# EAGLE design TOP_BEE_DEMO (EAGLE 6.5.0)
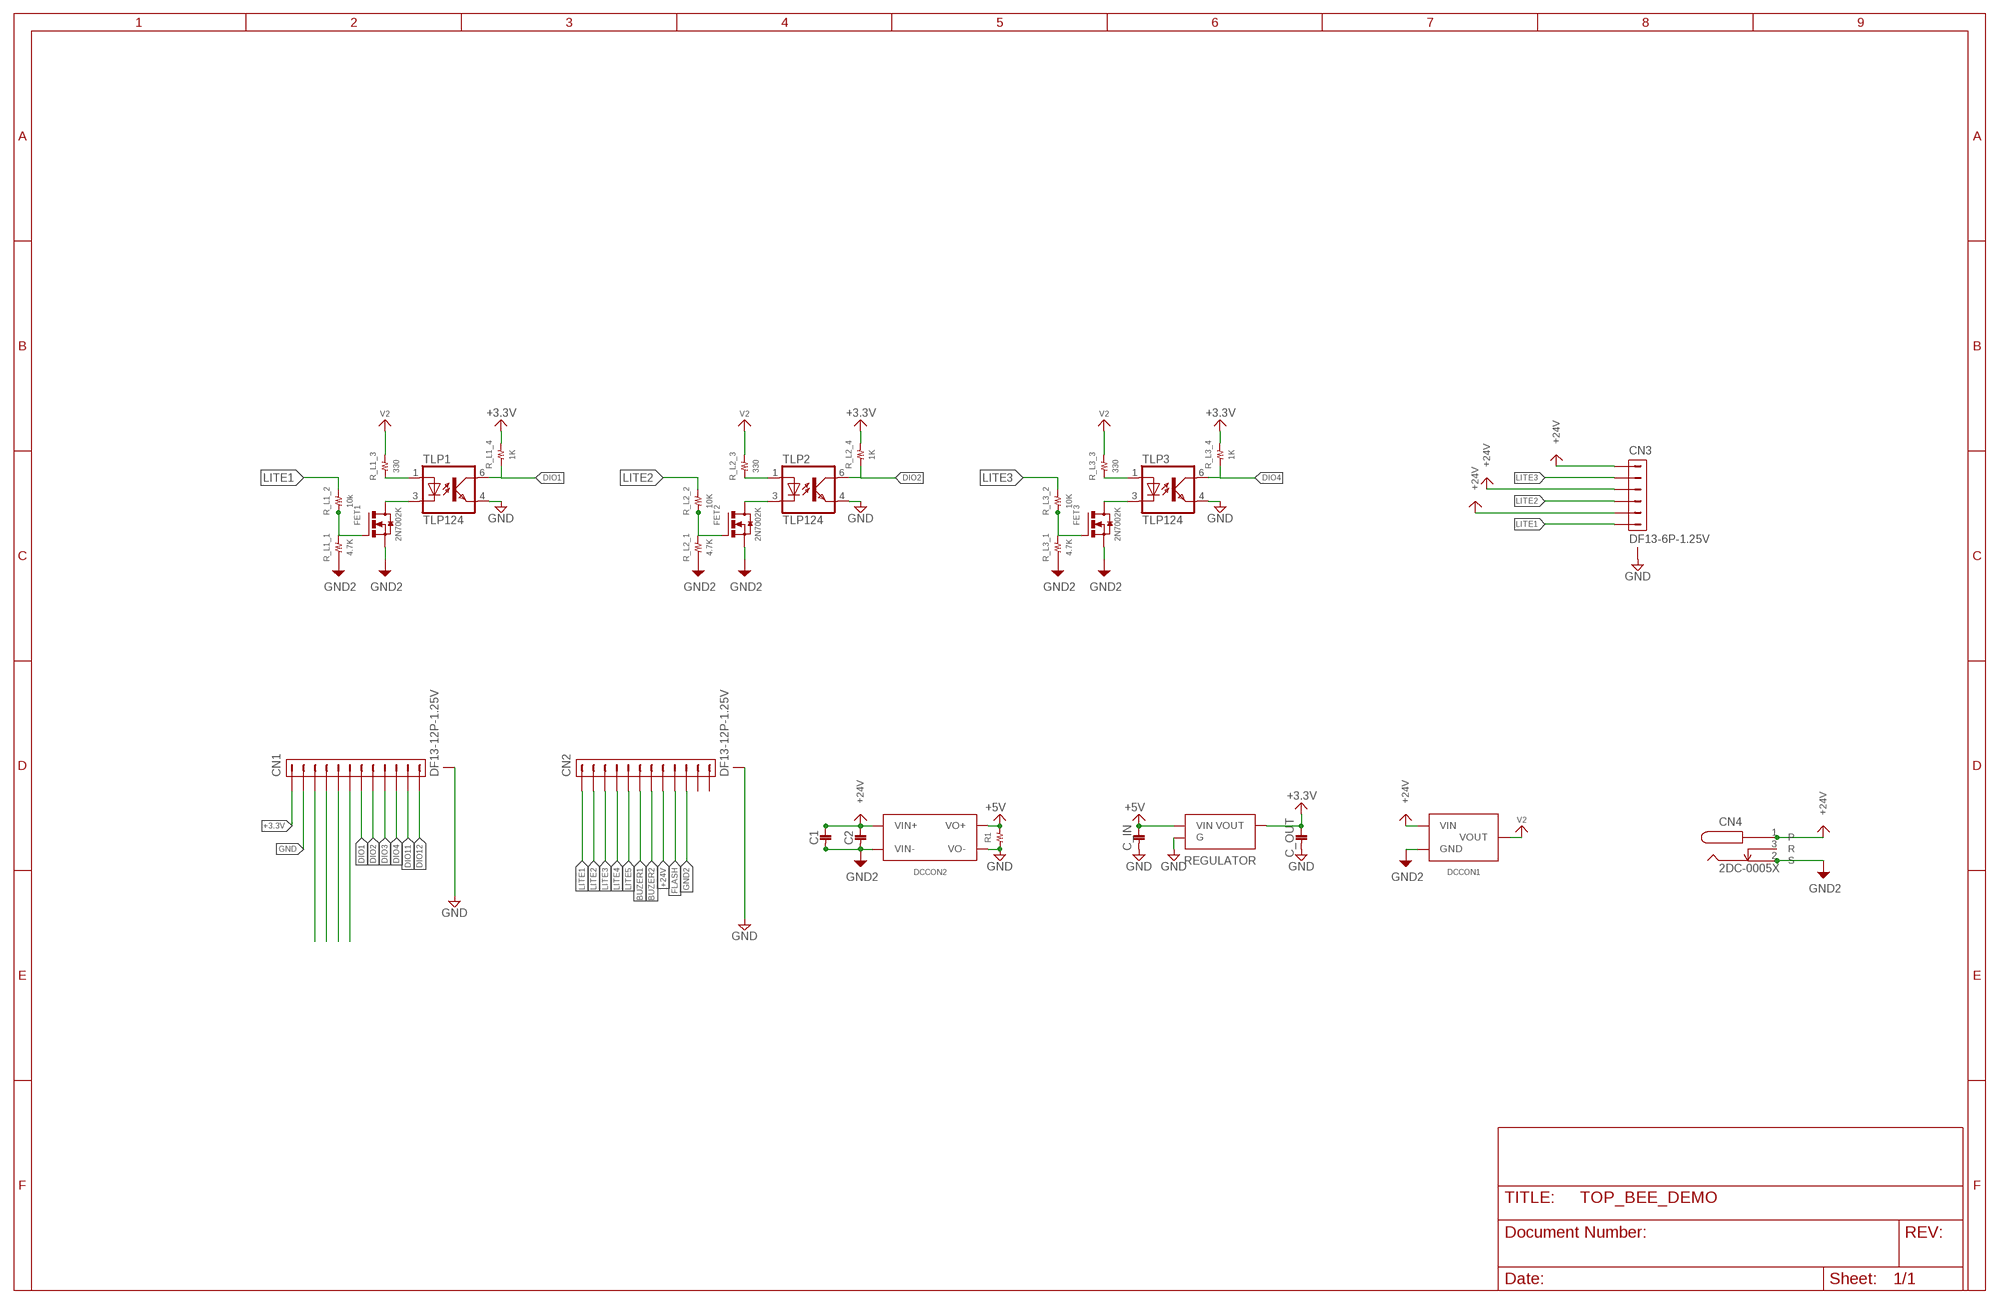
[diagram p0: schematic, sheet 1]

## Parts
C1  3225  [3225]
C2  1608  [1608]
C_IN  1608  [1608]
C_OUT  1608  [1608]
CN1  DF13-12P-1.25V  [DF13C-12P-1.25V]
CN2  DF13-12P-1.25V  [DF13C-12P-1.25V]
CN3  DF13-6P-1.25V  [DF13C-6P-1.25V]
CN4  2DC-0005X  [2DC-0005D]
DCCON1  Ｒ－７８Ｅ５．０  [Ｒ－７８Ｅ５．０]
DCCON2  MAU100  [MAU]
FET1  2N7002K  CHIP_FET  [SOT23]
FET2  2N7002K  CHIP_FET  [SOT23]
FET3  2N7002K  CHIP_FET  [SOT23]
R1  RESISTOR__SMD  [1608]
R_L1_1  4.7K  RESISTOR__SMD  [1608]
R_L1_2  10k  RESISTOR__SMD  [1608]
R_L1_3  330  RESISTOR__SMD  [1608]
R_L1_4  1K  RESISTOR__SMD  [1608]
R_L2_1  4.7K  RESISTOR__SMD  [1608]
R_L2_2  10K  RESISTOR__SMD  [1608]
R_L2_3  330  RESISTOR__SMD  [1608]
R_L2_4  1K  RESISTOR__SMD  [1608]
R_L3_1  4.7K  RESISTOR__SMD  [1608]
R_L3_2  10K  RESISTOR__SMD  [1608]
R_L3_3  330  RESISTOR__SMD  [1608]
R_L3_4  1K  RESISTOR__SMD  [1608]
REGULATOR  NJM2845  [TO252]
TLP1  TLP124  [11−4C1]
TLP2  TLP124  [11−4C1]
TLP3  TLP124  [11−4C1]

## Nets
2N7002K: FET1.1(G) R_L1_1.2 R_L1_2.1
+3.3V: C_OUT.P$1 CN1.P$1 R_L1_4.2 R_L2_4.2 R_L3_4.2 REGULATOR.3(VOUT)
+5V: C_IN.P$1 DCCON2.P$5(VO+) R1.2 REGULATOR.1(VIN)
+24V [24v]: C1.P$1 C2.P$1 CN2.P$8 CN3.P$1 CN3.P$3 CN3.P$5 CN4.1(P) DCCON1.1(VIN) DCCON2.P$1(VIN+)
BUZER1: CN2.P$6
BUZER2: CN2.P$7
DIO1: CN1.P$7 R_L1_4.1 TLP1.6(COL)
DIO2: CN1.P$8 R_L2_4.1 TLP2.6(COL)
DIO3: CN1.P$9
DIO4: CN1.P$10 R_L3_4.1 TLP3.6(COL)
DIO11: CN1.P$11
DIO12: CN1.P$12
FLASH: CN2.P$9
GND: C_IN.P$2 C_OUT.P$2 CN1.G1(G) CN1.G2(G) CN1.M$0(G) CN1.M$1(G) CN1.P$2 CN2.G1(G) CN2.G2(G) CN2.M$0(G) CN2.M$1(G) CN3.G1(G) CN3.G2(G) CN3.M$0(G) CN3.M$1(G) DCCON2.P$3(VO-) R1.1 REGULATOR.2(G) TLP1.4(EMIT) TLP2.4(EMIT) TLP3.4(EMIT)
GND2 [24v]: C1.P$2 C2.P$2 CN2.P$10 CN4.2(S) DCCON1.2(GND) DCCON2.P$2(VIN-) FET1.2(S) FET2.2(S) FET3.2(S) R_L1_1.1 R_L2_1.1 R_L3_1.1
LITE1 [24vSig]: CN2.P$1 CN3.P$6 R_L1_2.2
LITE2 [24vSig]: CN2.P$2 CN3.P$4 R_L2_2.2
LITE3 [24vSig]: CN2.P$3 CN3.P$2 R_L3_2.2
LITE4: CN2.P$4
LITE5: CN2.P$5
N$1: FET2.3(D) TLP2.3(C)
N$2: FET1.3(D) TLP1.3(C)
N$3: R_L1_3.1 TLP1.1(A)
N$4: CN1.P$3
N$5: R_L2_3.1 TLP2.1(A)
N$6: FET2.1(G) R_L2_1.2 R_L2_2.1
N$7: FET3.3(D) TLP3.3(C)
N$8: R_L3_3.1 TLP3.1(A)
N$9: FET3.1(G) R_L3_1.2 R_L3_2.1
N$10: CN1.P$4
N$13: CN1.P$5
N$14: CN1.P$6
V2: DCCON1.3(VOUT) R_L1_3.2 R_L2_3.2 R_L3_3.2
Unconnected: CN2.P$11 CN2.P$12 CN4.3(R)

## Library data of the parts
C1 = 02_C:3225
C2 C_IN C_OUT = 02_C:1608
CN1 CN2 = con-hirose-df13:DF13-12P-1.25: DF13-12P 1.25mm Pitch Miniature Crimping Connector.
CN3 = con-hirose-df13:DF13-6P-1.25: DF13-6P 1.25mm Pitch Miniature Crimping Connector.
CN4 = marushin:2DC-0005X
DCCON1 = 04_IC:Ｒ－７８Ｅ５．０
DCCON2 = 04_IC:MAU100
FET1-FET3 = 06_FET:CHIP_FET
R1 R_L1_1-R_L1_4 R_L2_1-R_L2_4 R_L3_1-R_L3_4 = 01_R:RESISTOR__SMD
REGULATOR = 04_IC:NJM2845
TLP1-TLP3 = 04_IC:TLP124

## Net classes
0 default: width 0.4 mm, clearance 0.3 mm
1 24v: width 0.4 mm, clearance 0.5 mm
2 10v: width 0.008 mm
3 24vSig: width 0.3 mm, clearance 0.5 mm

## Board
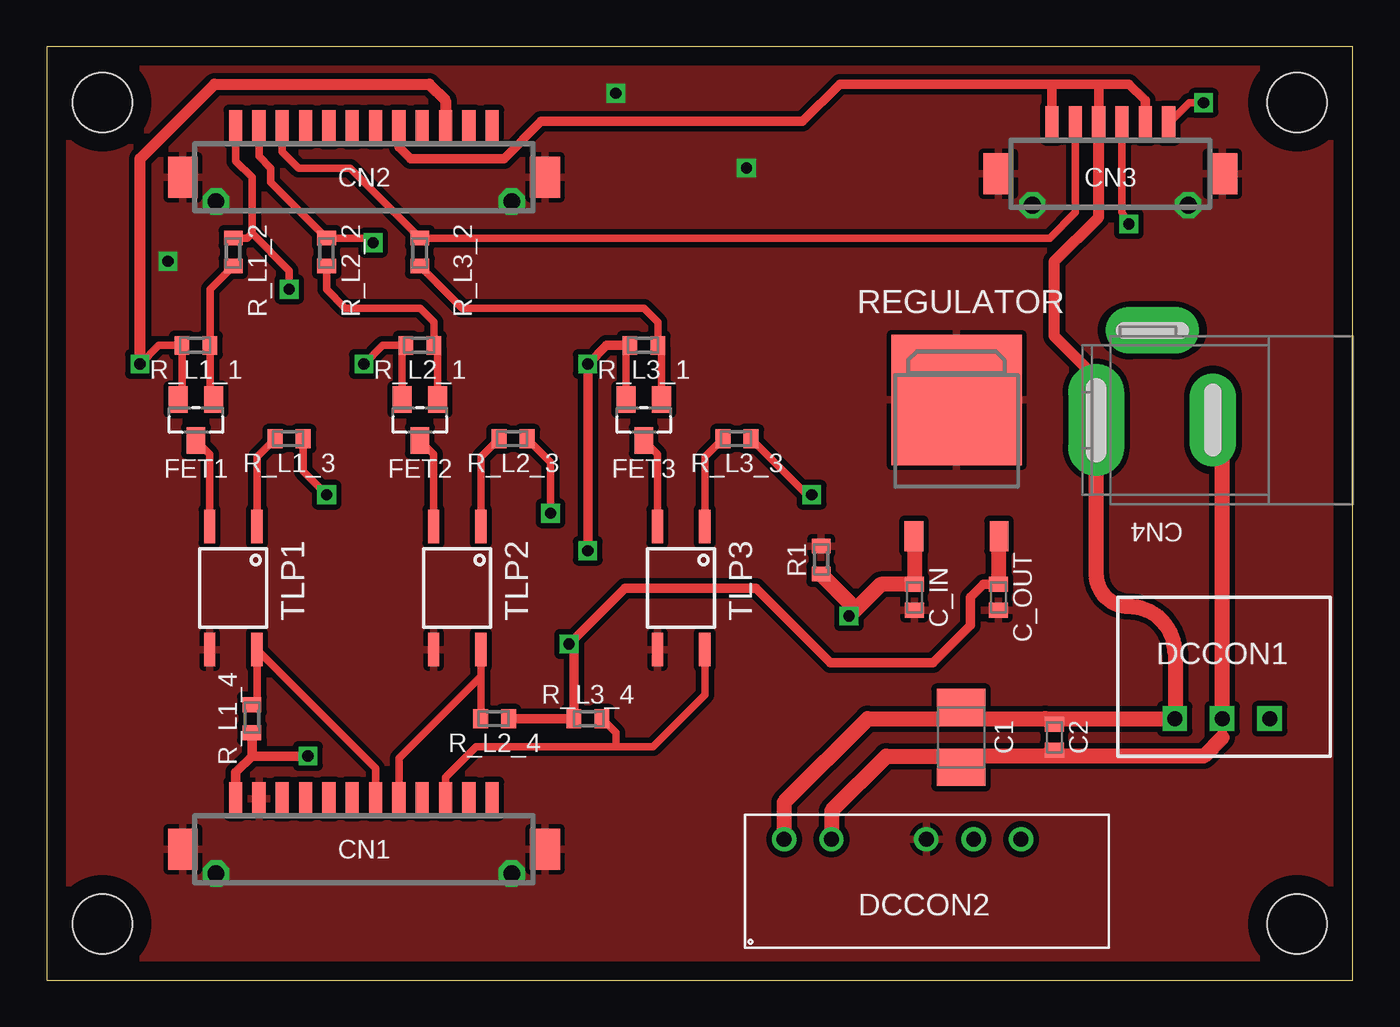
[diagram p1: board, top side]
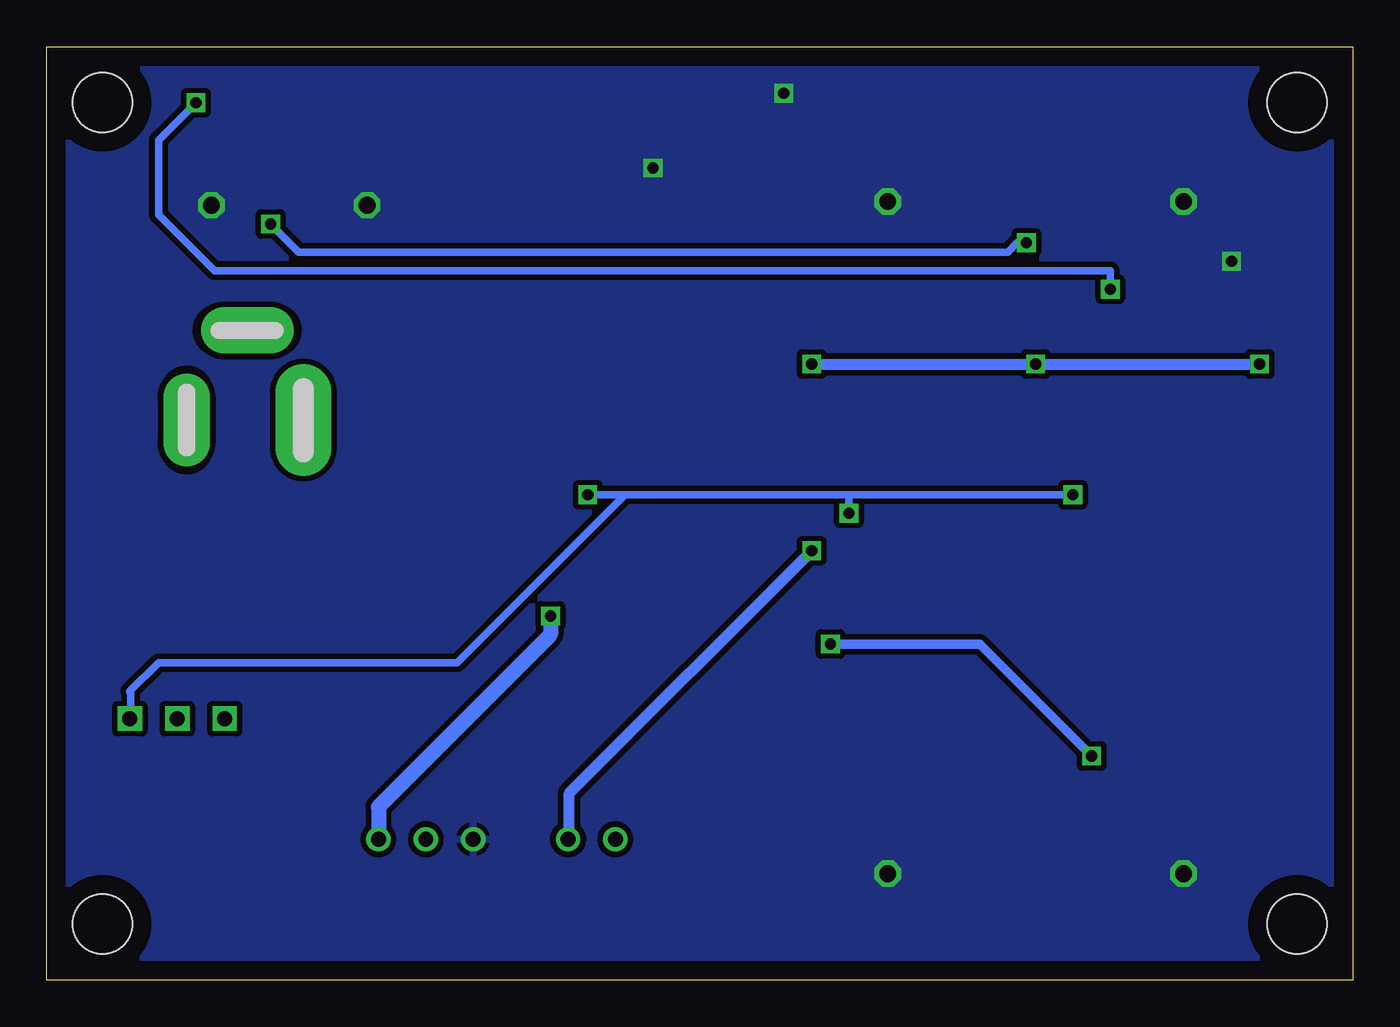
[diagram p2: board, bottom side, seen from below]

Size 70 x 50 mm. Coordinates in mm from the lower left corner, seen from the top.
Outline: 0,0 70,0 70,50 0,50 0,0
Copper layers (1*16): Top 0.035mm / dielectric 1.5mm / Bottom 0.035mm
Design rules "default *": minimum track width 10mil, minimum drill 0.5mil, track to track 8mil, track to pad 8mil, pad to pad 8mil, via to via 8mil, smd to smd 8mil, copper to edge 40mil, drill to drill 8mil, minimum pad ring 10mil, minimum via ring 8mil, stop-mask expansion 4mil, vias tented up to drill 0mil, thermal gap 10mil
Holes 3.2 mm at 3,47 67,47 67,3 3,3

### Footprints (pad centres in the part's own frame; a part is rotated, then mirrored left to right if it is on the bottom)
3225 = smd 2 x 2.6: P$1 -1.6,0; P$2 1.6,0
1608 = smd 0.8 x 1: P$1 -0.7,0; P$2 0.7,0
DF13C-12P-1.25V = drill 0.9 octagon: G1 -7.925,-1.3; G2 7.925,-1.3 | smd 1.6 x 2.2: M$0 9.7,0; M$1 -9.7,0 | smd 0.7 x 1.8: P$1 -6.875,2.7; P$2 -5.625,2.7; P$3 -4.375,2.7; P$4 -3.125,2.7; P$5 -1.875,2.7; P$6 -0.625,2.7; P$7 0.625,2.7; P$8 1.875,2.7; P$9 3.125,2.7; P$10 4.375,2.7; P$11 5.625,2.7; P$12 6.875,2.7
DF13C-6P-1.25V = drill 0.9 octagon: G1 -4.175,-3.5; G2 4.175,-3.5 | smd 1.6 x 2.2: M$0 6,-1.8; M$1 -6,-1.8 | smd 0.7 x 1.8: P$1 -3.125,0.9; P$2 -1.875,0.9; P$3 -0.625,0.9; P$4 0.625,0.9; P$5 1.875,0.9; P$6 3.125,0.9
2DC-0005D = drill 0.8 pad 3 long: 1 6.25,0 | drill 0.8 pad 2.5 long: 2 0,0; 3 3.25,-4.8 | hole 0.8: 0,0.1; 0,0.2; 0,0.3; 0,0.4; 0,0.5; 0,0.6; 0,0.7; 0,0.8; 0,0.9; 0,1; 0,1.1; 0,1.2; 0,1.3; 0,1.4; 0,1.5; 0,-0.1; 0,-0.2; 0,-0.3; 0,-0.4; 0,-0.5; 0,-0.6; 0,-0.7; 0,-0.8; 0,-0.9; 0,-1; 0,-1.1; 0,-1.2; 0,-1.3; 0,-1.4; 0,-1.5; 3.25,-4.8; 3.35,-4.8; 3.45,-4.8; 3.55,-4.8; 3.65,-4.8; 3.75,-4.8; 3.85,-4.8; 3.95,-4.8; 4.05,-4.8; 4.15,-4.8; 4.25,-4.8; 4.35,-4.8; 4.45,-4.8; 4.55,-4.8; 4.65,-4.8; 4.75,-4.8; 3.15,-4.8; 3.05,-4.8; 2.95,-4.8; 2.85,-4.8; 2.75,-4.8; 2.65,-4.8; 2.55,-4.8; 2.45,-4.8; 2.35,-4.8; 2.25,-4.8; 2.15,-4.8; 2.05,-4.8; 1.95,-4.8; 1.85,-4.8; 1.75,-4.8 | hole 1: 6.25,0; 6.25,0.1; 6.25,0.2; 6.25,0.3; 6.25,0.4; 6.25,0.5; 6.25,0.7; 6.25,0.6; 6.25,0.8; 6.25,0.9; 6.25,0.9; 6.25,1; 6.25,1.1; 6.25,1.2; 6.25,1.3; 6.25,1.4; 6.25,1.5; 6.25,1.6; 6.25,1.7; 6.25,-0.1; 6.25,-0.2; 6.25,-0.3; 6.25,-0.4; 6.25,-0.5; 6.25,-0.6; 6.25,-0.7; 6.25,-0.8; 6.25,-0.9; 6.25,-1; 6.25,-1.1; 6.25,-1.2; 6.25,-1.3; 6.25,-1.4; 6.25,-1.5; 6.25,-1.6; 6.25,-1.7
Ｒ－７８Ｅ５．０ = drill 0.8 square: 1 -2.54,0; 2 0,0; 3 2.54,0
MAU = drill 0.8: P$1 0,0; P$2 2.54,0; P$3 7.62,0; P$4 10.16,0; P$5 12.7,0
SOT23 = smd 1 x 1.4: 1 -0.95,-1.1; 2 0.95,-1.1; 3 0,1.1
1608' = smd 0.8 x 1: 1 -0.75,0; 2 0.75,0
TO252 = smd 1 x 1.6: 1 -2.52,-6.22; 3 2.04,-6.22 | smd 7 x 7: 2 -0.24,1.08
11−4C1 = smd 0.6 x 1.8: 1 -1.27,-3.3; 3 1.27,-3.3; 4 1.27,3.3; 6 -1.27,3.3

### Placement (x,y rotation side)
C1  49,13 270 top
C2  54,13 270 top
C_IN  46.5,20.5 270 top
C_OUT  51,20.5 270 top
CN1  17,7 0 top
CN2  17,43 0 top
CN3  57,45 0 top
CN4  62.5,30 180 top
DCCON1  63,14 0 top
DCCON2  39.52,7.54 0 top
FET1  8,30 180 top
FET2  20,30 180 top
FET3  32,30 180 top
R1  [1608']  41.5,22.5 270 top
R_L1_1  4.7K  [1608']  8,34 0 top
R_L1_2  10k  [1608']  10,39 90 top
R_L1_3  330  [1608']  13,29 0 top
R_L1_4  1K  [1608']  11,14 270 top
R_L2_1  4.7K  [1608']  20,34 0 top
R_L2_2  10K  [1608']  15,39 90 top
R_L2_3  330  [1608']  25,29 0 top
R_L2_4  1K  [1608']  24,14 0 top
R_L3_1  4.7K  [1608']  32,34 0 top
R_L3_2  10K  [1608']  20,39 90 top
R_L3_3  330  [1608']  37,29 0 top
R_L3_4  1K  [1608']  29,14 180 top
REGULATOR  49,30 0 top
TLP1  10,21 180 top
TLP2  22,21 180 top
TLP3  34,21 180 top

### Tracks (layer width: path | path; a pad name or v marks a point on that pad's centre or on a via)
2N7002K
  Top 0.4: FET1.1 8.75,31.3 R_L1_1.2 8.75,37 R_L1_2.1
+3.3V  (via drill 0.6)
  Top 0.5: R_L2_4.2 R_L3_4.2 28.25,17.75 v28,18 31,21 38,21 42,17 47.5,17 49.5,19 49.5,20.5 50.2,21.2 C_OUT.P$1 | v14,12 11,12 | 11,12 10.12,11.12 CN1.P$1 | R_L1_4.2 11,12
  Top 0.8: C_OUT.P$1 51.04,21.24 REGULATOR.3
  Bottom 0.5: v28,18 20,18 v14,12
+5V  (via drill 0.6)
  Top 0.4: REGULATOR.1 46.5,23.26
  Top 0.8: 46.5,23.26 C_IN.P$1 44.7,21.2 v43,19.5 43,20.25 R1.2
  Bottom 0.8: v43,19.5 43,18.5 52.22,9.28 DCCON2.P$5
+24V
  Top 0.5: CN4.1 56.25,32.25 | CN3.P$3 56.38,48 | 56.38,48 53.88,48 | CN3.P$1 53.88,48 | 53.88,48 42.5,48 40.5,46 26.5,46 24.5,44 19.5,44 18.88,44.62 CN2.P$8 | CN3.P$5 58.88,47.12 58,48 56.38,48 | 60.5,14 DCCON1.1
  Top 0.6: 56.25,32.25 54,34.5 54,38.5 56.38,40.88 CN3.P$3
  Top 0.8: CN4.1 56.25,21.75 arc32 56.51,20.83 arc58 58,20 arc-90 60.46,17.54 60.5,17.5 60.5,14 | DCCON2.P$1 39.52,9.52 44,14 49,14 | 49,14 53.5,14 | 53.5,14 DCCON1.1 | 49,14 C1.P$1 | C2.P$1 53.5,14
DIO1
  Top 0.4: CN1.P$7 17.62,11.35 TLP1.6 11.27,15.02 R_L1_4.1
DIO2
  Top 0.4: TLP2.6 23.27,16.27 | 23.27,16.27 18.88,11.88 CN1.P$8 | R_L2_4.1 23.27,14.02 23.27,16.27
DIO3
  Top 0.4: 20.12,10.12 CN1.P$9
DIO4
  Top 0.4: TLP3.6 35.27,15.27 32.5,12.5 30.5,12.5 | 30.5,12.5 23,12.5 21.38,10.88 CN1.P$10 | R_L3_4.1 30.5,13.25 30.5,12.5
GND  (via drill 0.6)
  other vias: 37.5,43.5 6.5,38.5 30.5,47.5
  pour Top: 0,50 70,50 70,0 0,0
  pour Bottom: 0,50 70,50 70,0 0,0
GND2  (via drill 0.6)
  Top 0.4: FET1.2 7.25,31.3 R_L1_1.1 6,34 v5,33 | FET2.2 19.05,33.8 R_L2_1.1 18,34 v17,33 | FET3.2 31.05,33.8 R_L3_1.1
  Top 0.5: v29,23 v29,33 30,34 R_L3_1.1 | 63,13 DCCON1.2
  Top 0.6: v5,33 5,44 9,48 20.5,48 21.38,47.12 CN2.P$10
  Top 0.8: 63,29.5 arc90 CN4.2 63,29.5 | 63,13 62,12 53.5,12 | 53.5,12 49,12 | DCCON2.P$2 42.06,9.06 45,12 49,12 | DCCON1.2 63,29.5 | 49,12 C1.P$2 | C2.P$2 53.5,12
  Bottom 0.5: DCCON2.P$2 42,7.6
  Bottom 0.6: 42,7.6 42,10 v29,23 | v29,33 v17,33 v5,33
LITE1  (via drill 0.6)
  Top 0.4: 11,40 11,43 10.12,43.88 CN2.P$1 | v13,37 13,38 11,40 | 11,40 10.75,39.75 R_L1_2.2
  Top 0.406: v62,47 61.23,47 CN3.P$6
  Bottom 0.4: 57,38 13,38 v13,37
  Bottom 0.406: 57,38 61,38 64,41 64,45 v62,47
LITE2  (via drill 0.6)
  Top 0.4: CN2.P$2 11.38,44.12 12,43.5 12,42.75 R_L2_2.2 17.25,39.75 v17.5,39.5 | v58,40.5 57.62,41.12 CN3.P$4
  Bottom 0.4: v17.5,39.5 18,39.5 18.5,39 56.5,39 v58,40.5
LITE3
  Top 0.4: CN2.P$3 12.62,44.38 13.5,43.5 16.25,43.5 R_L3_2.2 53.75,39.75 55.12,41.12 CN3.P$2
N$1
  Top 0.4: TLP2.3 20.73,28.17 FET2.3
N$2
  Top 0.4: TLP1.3 8.73,28.17 FET1.3
N$3
  Top 0.4: TLP1.1 11.27,28.02 R_L1_3.1
N$5
  Top 0.4: TLP2.1 23.27,28.02 R_L2_3.1
N$6
  Top 0.4: R_L2_2.1 15,37 16,36 20,36 20.75,35.25 R_L2_1.2 20.95,33.8 FET2.1
N$7
  Top 0.4: TLP3.3 32.73,28.17 FET3.3
N$8
  Top 0.4: TLP3.1 35.27,28.02 R_L3_3.1
N$9
  Top 0.4: R_L3_2.1 22.25,36 32,36 32.75,35.25 R_L3_1.2 32.95,33.8 FET3.1
V2  (via drill 0.6)
  Top 0.4: R_L1_3.2 13.75,27.25 v15,26 | R_L2_3.2 27,27.75 v27,25 | R_L3_3.2 40.75,26 v41,26
  Bottom 0.4: v15,26 27,26 | 27,26 39,26 | 39,26 48,17 64,17 65.54,15.46 65.5,15.3 65.5,14 DCCON1.3 | v27,25 27,26 | v41,26 39,26